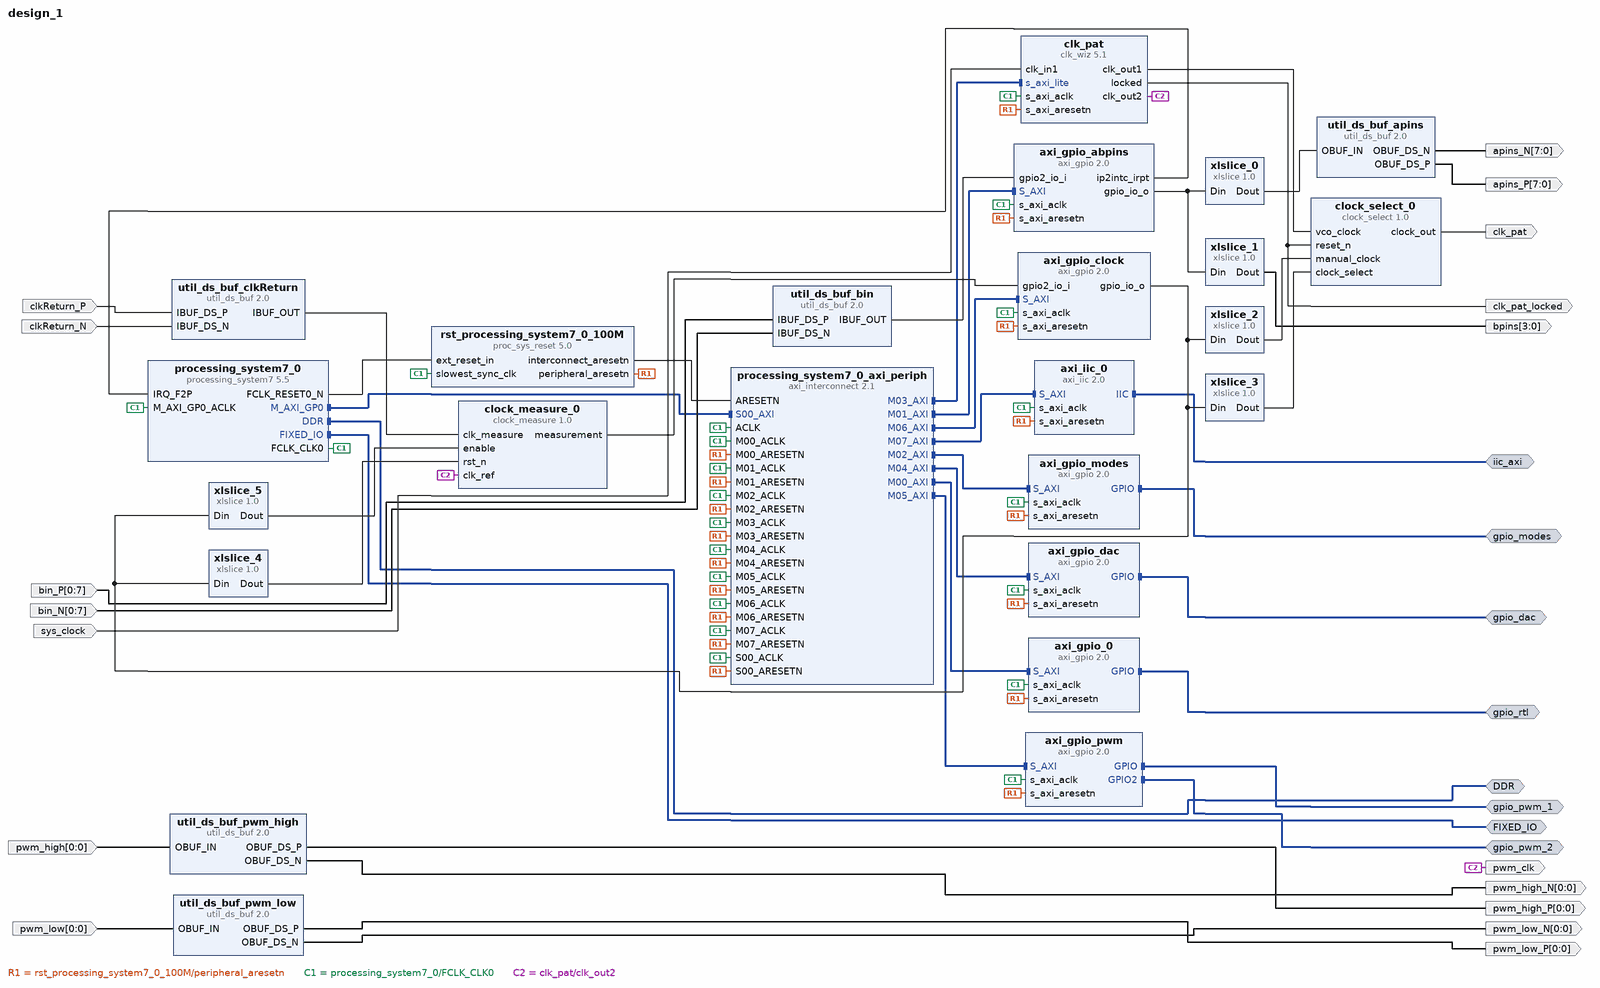
[diagram p0: block diagram of the top level]
# Vivado block design design_1, Vivado 2014.4
create_bd_design design_1

create_bd_intf_port -mode Master -vlnv xilinx.com:interface:ddrx_rtl:1.0 DDR
create_bd_intf_port -mode Master -vlnv xilinx.com:display_processing_system7:fixedio_rtl:1.0 FIXED_IO
create_bd_intf_port -mode Master -vlnv xilinx.com:interface:gpio_rtl:1.0 gpio_rtl
create_bd_intf_port -mode Master -vlnv xilinx.com:interface:gpio_rtl:1.0 gpio_modes
create_bd_intf_port -mode Master -vlnv xilinx.com:interface:gpio_rtl:1.0 gpio_dac
create_bd_intf_port -mode Master -vlnv xilinx.com:interface:gpio_rtl:1.0 gpio_pwm_1
create_bd_intf_port -mode Master -vlnv xilinx.com:interface:gpio_rtl:1.0 gpio_pwm_2
create_bd_intf_port -mode Master -vlnv xilinx.com:interface:iic_rtl:1.0 iic_axi
create_bd_port -dir I -from 0 -to 7 bin_P
create_bd_port -dir I -from 0 -to 7 bin_N
create_bd_port -dir O -from 3 -to 0 bpins
create_bd_port -dir I -type clk sys_clock
set_property -dict {CONFIG.FREQ_HZ 100000000 CONFIG.PHASE 0.000} [get_bd_ports sys_clock]
create_bd_port -dir O -from 0 -to 0 pwm_high_P
create_bd_port -dir O -from 0 -to 0 pwm_high_N
create_bd_port -dir O -from 0 -to 0 pwm_low_P
create_bd_port -dir O -from 0 -to 0 pwm_low_N
create_bd_port -dir I clkReturn_P
create_bd_port -dir I clkReturn_N
create_bd_port -dir O clk_pat
create_bd_port -dir I -from 0 -to 0 pwm_low
create_bd_port -dir I -from 0 -to 0 pwm_high
create_bd_port -dir O -type clk pwm_clk
create_bd_port -dir O clk_pat_locked
create_bd_port -dir O -from 7 -to 0 apins_P
create_bd_port -dir O -from 7 -to 0 apins_N

create_bd_cell -type ip -vlnv xilinx.com:ip:processing_system7:5.5 processing_system7_0
set_property -dict [list \
  CONFIG.PCW_USE_FABRIC_INTERRUPT 1 \
  CONFIG.PCW_IRQ_F2P_INTR 1 \
  CONFIG.PCW_SPI1_PERIPHERAL_ENABLE 1 \
  CONFIG.PCW_SPI1_SPI1_IO {MIO 10 .. 15} \
  CONFIG.PCW_I2C0_PERIPHERAL_ENABLE 1 \
  CONFIG.PCW_I2C0_I2C0_IO {MIO 14 .. 15} \
  CONFIG.PCW_I2C0_GRP_INT_ENABLE 0 \
  CONFIG.preset {ZedBoard*} \
] [get_bd_cells processing_system7_0]
# 10 more settings of processing_system7_0 are not shown: defaults, MIO pin electricals, DDR timing, and values the tool derives
create_bd_cell -type ip -vlnv xilinx.com:ip:axi_gpio:2.0 axi_gpio_0
set_property -dict [list \
  CONFIG.C_GPIO_WIDTH 16 \
  CONFIG.C_ALL_INPUTS 0 \
  CONFIG.USE_BOARD_FLOW true \
  CONFIG.GPIO_BOARD_INTERFACE Custom \
] [get_bd_cells axi_gpio_0]
create_bd_cell -type ip -vlnv xilinx.com:ip:axi_gpio:2.0 axi_gpio_modes
set_property -dict [list \
  CONFIG.C_GPIO_WIDTH 5 \
  CONFIG.C_ALL_INPUTS 0 \
  CONFIG.USE_BOARD_FLOW true \
  CONFIG.GPIO_BOARD_INTERFACE Custom \
  CONFIG.C_ALL_OUTPUTS 1 \
] [get_bd_cells axi_gpio_modes]
create_bd_cell -type ip -vlnv xilinx.com:ip:proc_sys_reset:5.0 rst_processing_system7_0_100M
create_bd_cell -type ip -vlnv xilinx.com:ip:axi_gpio:2.0 axi_gpio_dac
set_property -dict [list \
  CONFIG.C_GPIO_WIDTH 11 \
  CONFIG.C_DOUT_DEFAULT 0x00000400 \
  CONFIG.USE_BOARD_FLOW true \
  CONFIG.GPIO_BOARD_INTERFACE Custom \
  CONFIG.C_ALL_OUTPUTS 1 \
] [get_bd_cells axi_gpio_dac]
create_bd_cell -type ip -vlnv xilinx.com:ip:xlslice:1.0 xlslice_0
set_property -dict {CONFIG.DIN_TO 0 CONFIG.DIN_FROM 7 CONFIG.DIN_WIDTH 12} [get_bd_cells xlslice_0]
create_bd_cell -type ip -vlnv xilinx.com:ip:xlslice:1.0 xlslice_1
set_property -dict {CONFIG.DIN_TO 8 CONFIG.DIN_FROM 11 CONFIG.DIN_WIDTH 12} [get_bd_cells xlslice_1]
create_bd_cell -type ip -vlnv xilinx.com:ip:axi_gpio:2.0 axi_gpio_abpins
set_property -dict [list \
  CONFIG.C_GPIO_WIDTH 12 \
  CONFIG.C_GPIO2_WIDTH 8 \
  CONFIG.C_IS_DUAL 1 \
  CONFIG.C_ALL_INPUTS 0 \
  CONFIG.C_ALL_INPUTS_2 1 \
  CONFIG.C_INTERRUPT_PRESENT 1 \
  CONFIG.USE_BOARD_FLOW true \
  CONFIG.GPIO_BOARD_INTERFACE Custom \
  CONFIG.GPIO2_BOARD_INTERFACE Custom \
  CONFIG.C_ALL_OUTPUTS 1 \
] [get_bd_cells axi_gpio_abpins]
create_bd_cell -type ip -vlnv xilinx.com:ip:axi_gpio:2.0 axi_gpio_pwm
set_property -dict [list \
  CONFIG.C_GPIO_WIDTH 30 \
  CONFIG.C_GPIO2_WIDTH 20 \
  CONFIG.C_IS_DUAL 1 \
  CONFIG.C_DOUT_DEFAULT_2 0x0f0f0e0F \
  CONFIG.C_DOUT_DEFAULT 0xff00ff00 \
  CONFIG.C_ALL_OUTPUTS 1 \
  CONFIG.C_ALL_OUTPUTS_2 1 \
] [get_bd_cells axi_gpio_pwm]
create_bd_cell -type ip -vlnv xilinx.com:ip:axi_gpio:2.0 axi_gpio_clock
set_property -dict [list \
  CONFIG.C_GPIO_WIDTH 4 \
  CONFIG.C_GPIO2_WIDTH 20 \
  CONFIG.C_IS_DUAL 1 \
  CONFIG.C_DOUT_DEFAULT 0x00000000 \
  CONFIG.C_ALL_INPUTS_2 1 \
  CONFIG.C_INTERRUPT_PRESENT 0 \
  CONFIG.C_ALL_OUTPUTS 1 \
] [get_bd_cells axi_gpio_clock]
create_bd_cell -type ip -vlnv xilinx.com:ip:clk_wiz:5.1 clk_pat
set_property -dict [list \
  CONFIG.USE_PHASE_ALIGNMENT false \
  CONFIG.USE_DYN_PHASE_SHIFT false \
  CONFIG.USE_DYN_RECONFIG true \
  CONFIG.JITTER_SEL Min_O_Jitter \
  CONFIG.CLKOUT2_USED true \
  CONFIG.CLKOUT3_USED false \
  CONFIG.NUM_OUT_CLKS 2 \
  CONFIG.CLKOUT1_REQUESTED_OUT_FREQ 20 \
  CONFIG.CLKOUT2_REQUESTED_OUT_FREQ 100 \
  CONFIG.CLKOUT1_DRIVES BUFGCE \
  CONFIG.CLKOUT2_DRIVES BUFGCE \
  CONFIG.USE_SAFE_CLOCK_STARTUP true \
  CONFIG.USE_BOARD_FLOW true \
  CONFIG.CLK_IN1_BOARD_INTERFACE sys_clock \
  CONFIG.CLKOUT1_JITTER 174.686 \
  CONFIG.CLKOUT1_PHASE_ERROR 92.672 \
  CONFIG.CLKOUT2_JITTER 123.670 \
  CONFIG.CLKOUT2_PHASE_ERROR 92.672 \
  CONFIG.CLKOUT3_JITTER 97.082 \
  CONFIG.CLKOUT3_PHASE_ERROR 98.575 \
] [get_bd_cells clk_pat]
create_bd_cell -type ip -vlnv xilinx.com:ip:axi_interconnect:2.1 processing_system7_0_axi_periph
set_property -dict {CONFIG.NUM_MI 8} [get_bd_cells processing_system7_0_axi_periph]
create_bd_cell -type ip -vlnv xilinx.com:ip:util_ds_buf:2.0 util_ds_buf_bin
set_property -dict {CONFIG.C_SIZE 8} [get_bd_cells util_ds_buf_bin]
create_bd_cell -type ip -vlnv xilinx.com:ip:util_ds_buf:2.0 util_ds_buf_pwm_high
set_property -dict {CONFIG.C_BUF_TYPE OBUFDS} [get_bd_cells util_ds_buf_pwm_high]
create_bd_cell -type ip -vlnv xilinx.com:ip:util_ds_buf:2.0 util_ds_buf_pwm_low
set_property -dict {CONFIG.C_BUF_TYPE OBUFDS} [get_bd_cells util_ds_buf_pwm_low]
create_bd_cell -type ip -vlnv xilinx.com:ip:util_ds_buf:2.0 util_ds_buf_clkReturn
create_bd_cell -type ip -vlnv ac.uk:user:clock_select:1.0 clock_select_0
create_bd_cell -type ip -vlnv xilinx.com:ip:xlslice:1.0 xlslice_2
set_property -dict {CONFIG.DIN_WIDTH 4} [get_bd_cells xlslice_2]
create_bd_cell -type ip -vlnv xilinx.com:ip:xlslice:1.0 xlslice_3
set_property -dict {CONFIG.DIN_TO 1 CONFIG.DIN_FROM 1 CONFIG.DIN_WIDTH 4} [get_bd_cells xlslice_3]
create_bd_cell -type ip -vlnv simon.cs.bris.ac.uk:user:clock_measure:1.0 clock_measure_0
create_bd_cell -type ip -vlnv xilinx.com:ip:xlslice:1.0 xlslice_4
set_property -dict {CONFIG.DIN_TO 2 CONFIG.DIN_FROM 2 CONFIG.DIN_WIDTH 4} [get_bd_cells xlslice_4]
create_bd_cell -type ip -vlnv xilinx.com:ip:xlslice:1.0 xlslice_5
set_property -dict {CONFIG.DIN_TO 3 CONFIG.DIN_FROM 3 CONFIG.DIN_WIDTH 4} [get_bd_cells xlslice_5]
create_bd_cell -type ip -vlnv xilinx.com:ip:axi_iic:2.0 axi_iic_0
create_bd_cell -type ip -vlnv xilinx.com:ip:util_ds_buf:2.0 util_ds_buf_apins
set_property -dict {CONFIG.C_SIZE 8 CONFIG.C_BUF_TYPE OBUFDS} [get_bd_cells util_ds_buf_apins]

# ---- connections ----

connect_bd_intf_net [get_bd_intf_pins processing_system7_0_axi_periph/M00_AXI] [get_bd_intf_pins axi_gpio_0/S_AXI]
connect_bd_intf_net [get_bd_intf_pins processing_system7_0_axi_periph/M02_AXI] [get_bd_intf_pins axi_gpio_modes/S_AXI]
connect_bd_intf_net [get_bd_intf_pins processing_system7_0_axi_periph/M01_AXI] [get_bd_intf_pins axi_gpio_abpins/S_AXI]
connect_bd_intf_net [get_bd_intf_pins processing_system7_0/M_AXI_GP0] [get_bd_intf_pins processing_system7_0_axi_periph/S00_AXI]
connect_bd_intf_net [get_bd_intf_pins processing_system7_0_axi_periph/M03_AXI] [get_bd_intf_pins clk_pat/s_axi_lite]
connect_bd_intf_net [get_bd_intf_pins processing_system7_0_axi_periph/M04_AXI] [get_bd_intf_pins axi_gpio_dac/S_AXI]
connect_bd_intf_net [get_bd_intf_pins processing_system7_0_axi_periph/M05_AXI] [get_bd_intf_pins axi_gpio_pwm/S_AXI]
connect_bd_intf_net [get_bd_intf_pins processing_system7_0_axi_periph/M06_AXI] [get_bd_intf_pins axi_gpio_clock/S_AXI]
connect_bd_intf_net [get_bd_intf_pins processing_system7_0_axi_periph/M07_AXI] [get_bd_intf_pins axi_iic_0/S_AXI]
connect_bd_intf_net [get_bd_intf_ports DDR] [get_bd_intf_pins processing_system7_0/DDR]
connect_bd_intf_net [get_bd_intf_ports FIXED_IO] [get_bd_intf_pins processing_system7_0/FIXED_IO]
connect_bd_intf_net [get_bd_intf_ports gpio_rtl] [get_bd_intf_pins axi_gpio_0/GPIO]
connect_bd_intf_net [get_bd_intf_ports gpio_modes] [get_bd_intf_pins axi_gpio_modes/GPIO]
connect_bd_intf_net [get_bd_intf_ports gpio_dac] [get_bd_intf_pins axi_gpio_dac/GPIO]
connect_bd_intf_net [get_bd_intf_ports gpio_pwm_1] [get_bd_intf_pins axi_gpio_pwm/GPIO]
connect_bd_intf_net [get_bd_intf_ports gpio_pwm_2] [get_bd_intf_pins axi_gpio_pwm/GPIO2]
connect_bd_intf_net [get_bd_intf_ports iic_axi] [get_bd_intf_pins axi_iic_0/IIC]
connect_bd_net [get_bd_pins processing_system7_0/FCLK_RESET0_N] [get_bd_pins rst_processing_system7_0_100M/ext_reset_in]
connect_bd_net [get_bd_pins rst_processing_system7_0_100M/peripheral_aresetn] \
  [get_bd_pins axi_gpio_0/s_axi_aresetn] [get_bd_pins axi_gpio_modes/s_axi_aresetn] [get_bd_pins axi_gpio_dac/s_axi_aresetn] \
  [get_bd_pins axi_gpio_abpins/s_axi_aresetn] [get_bd_pins axi_gpio_pwm/s_axi_aresetn] [get_bd_pins clk_pat/s_axi_aresetn] \
  [get_bd_pins axi_gpio_clock/s_axi_aresetn] [get_bd_pins axi_iic_0/s_axi_aresetn] \
  [get_bd_pins processing_system7_0_axi_periph/S00_ARESETN] [get_bd_pins processing_system7_0_axi_periph/M00_ARESETN] \
  [get_bd_pins processing_system7_0_axi_periph/M01_ARESETN] [get_bd_pins processing_system7_0_axi_periph/M02_ARESETN] \
  [get_bd_pins processing_system7_0_axi_periph/M03_ARESETN] [get_bd_pins processing_system7_0_axi_periph/M04_ARESETN] \
  [get_bd_pins processing_system7_0_axi_periph/M05_ARESETN] [get_bd_pins processing_system7_0_axi_periph/M06_ARESETN] \
  [get_bd_pins processing_system7_0_axi_periph/M07_ARESETN]
connect_bd_net [get_bd_pins rst_processing_system7_0_100M/interconnect_aresetn] [get_bd_pins processing_system7_0_axi_periph/ARESETN]
connect_bd_net -net IBUF_DS_P_1 [get_bd_ports bin_P] [get_bd_pins util_ds_buf_bin/IBUF_DS_P]
connect_bd_net -net IBUF_DS_N_1 [get_bd_ports bin_N] [get_bd_pins util_ds_buf_bin/IBUF_DS_N]
connect_bd_net [get_bd_pins axi_gpio_abpins/gpio_io_o] [get_bd_pins xlslice_0/Din] [get_bd_pins xlslice_1/Din]
connect_bd_net [get_bd_pins xlslice_1/Dout] [get_bd_ports bpins]
connect_bd_net [get_bd_pins util_ds_buf_bin/IBUF_OUT] [get_bd_pins axi_gpio_abpins/gpio2_io_i]
connect_bd_net [get_bd_pins axi_gpio_abpins/ip2intc_irpt] [get_bd_pins processing_system7_0/IRQ_F2P]
connect_bd_net [get_bd_pins processing_system7_0/FCLK_CLK0] \
  [get_bd_pins processing_system7_0/M_AXI_GP0_ACLK] [get_bd_pins rst_processing_system7_0_100M/slowest_sync_clk] \
  [get_bd_pins axi_gpio_0/s_axi_aclk] [get_bd_pins axi_gpio_modes/s_axi_aclk] [get_bd_pins axi_gpio_dac/s_axi_aclk] \
  [get_bd_pins axi_gpio_abpins/s_axi_aclk] [get_bd_pins axi_gpio_pwm/s_axi_aclk] [get_bd_pins clk_pat/s_axi_aclk] \
  [get_bd_pins axi_gpio_clock/s_axi_aclk] [get_bd_pins axi_iic_0/s_axi_aclk] \
  [get_bd_pins processing_system7_0_axi_periph/ACLK] [get_bd_pins processing_system7_0_axi_periph/S00_ACLK] \
  [get_bd_pins processing_system7_0_axi_periph/M00_ACLK] [get_bd_pins processing_system7_0_axi_periph/M01_ACLK] \
  [get_bd_pins processing_system7_0_axi_periph/M02_ACLK] [get_bd_pins processing_system7_0_axi_periph/M03_ACLK] \
  [get_bd_pins processing_system7_0_axi_periph/M04_ACLK] [get_bd_pins processing_system7_0_axi_periph/M05_ACLK] \
  [get_bd_pins processing_system7_0_axi_periph/M06_ACLK] [get_bd_pins processing_system7_0_axi_periph/M07_ACLK]
connect_bd_net [get_bd_ports sys_clock] [get_bd_pins clk_pat/clk_in1]
connect_bd_net [get_bd_pins util_ds_buf_pwm_high/OBUF_DS_P] [get_bd_ports pwm_high_P]
connect_bd_net [get_bd_pins util_ds_buf_pwm_high/OBUF_DS_N] [get_bd_ports pwm_high_N]
connect_bd_net [get_bd_pins util_ds_buf_pwm_low/OBUF_DS_P] [get_bd_ports pwm_low_P]
connect_bd_net [get_bd_pins util_ds_buf_pwm_low/OBUF_DS_N] [get_bd_ports pwm_low_N]
connect_bd_net [get_bd_ports clkReturn_P] [get_bd_pins util_ds_buf_clkReturn/IBUF_DS_P]
connect_bd_net [get_bd_ports clkReturn_N] [get_bd_pins util_ds_buf_clkReturn/IBUF_DS_N]
connect_bd_net [get_bd_pins xlslice_2/Dout] [get_bd_pins clock_select_0/manual_clock]
connect_bd_net [get_bd_pins xlslice_3/Dout] [get_bd_pins clock_select_0/clock_select]
connect_bd_net [get_bd_pins clk_pat/clk_out1] [get_bd_pins clock_select_0/vco_clock]
connect_bd_net [get_bd_pins clock_select_0/clock_out] [get_bd_ports clk_pat]
connect_bd_net [get_bd_pins axi_gpio_clock/gpio_io_o] \
  [get_bd_pins xlslice_2/Din] [get_bd_pins xlslice_3/Din] [get_bd_pins xlslice_4/Din] [get_bd_pins xlslice_5/Din]
connect_bd_net [get_bd_ports pwm_low] [get_bd_pins util_ds_buf_pwm_low/OBUF_IN]
connect_bd_net [get_bd_ports pwm_high] [get_bd_pins util_ds_buf_pwm_high/OBUF_IN]
connect_bd_net [get_bd_pins clk_pat/clk_out2] [get_bd_ports pwm_clk] [get_bd_pins clock_measure_0/clk_ref]
connect_bd_net [get_bd_pins util_ds_buf_clkReturn/IBUF_OUT] [get_bd_pins clock_measure_0/clk_measure]
connect_bd_net [get_bd_pins xlslice_5/Dout] [get_bd_pins clock_measure_0/enable]
connect_bd_net [get_bd_pins xlslice_4/Dout] [get_bd_pins clock_measure_0/rst_n]
connect_bd_net [get_bd_pins clock_measure_0/measurement] [get_bd_pins axi_gpio_clock/gpio2_io_i]
connect_bd_net [get_bd_pins clk_pat/locked] [get_bd_ports clk_pat_locked] [get_bd_pins clock_select_0/reset_n]
connect_bd_net [get_bd_pins xlslice_0/Dout] [get_bd_pins util_ds_buf_apins/OBUF_IN]
connect_bd_net -net util_ds_buf_0_OBUF_DS_P [get_bd_pins util_ds_buf_apins/OBUF_DS_P] [get_bd_ports apins_P]
connect_bd_net -net util_ds_buf_0_OBUF_DS_N [get_bd_pins util_ds_buf_apins/OBUF_DS_N] [get_bd_ports apins_N]

# ---- address map ----
assign_bd_address -offset 0x41200000 -range 64K -target_address_space [get_bd_addr_spaces processing_system7_0/Data] [get_bd_addr_segs axi_gpio_dac/S_AXI/Reg]
assign_bd_address -offset 0x41210000 -range 64K -target_address_space [get_bd_addr_spaces processing_system7_0/Data] [get_bd_addr_segs axi_gpio_pwm/S_AXI/Reg]
assign_bd_address -offset 0x41220000 -range 64K -target_address_space [get_bd_addr_spaces processing_system7_0/Data] [get_bd_addr_segs axi_gpio_0/S_AXI/Reg]
assign_bd_address -offset 0x41230000 -range 64K -target_address_space [get_bd_addr_spaces processing_system7_0/Data] [get_bd_addr_segs axi_gpio_modes/S_AXI/Reg]
assign_bd_address -offset 0x41240000 -range 64K -target_address_space [get_bd_addr_spaces processing_system7_0/Data] [get_bd_addr_segs axi_gpio_abpins/S_AXI/Reg]
assign_bd_address -offset 0x41250000 -range 64K -target_address_space [get_bd_addr_spaces processing_system7_0/Data] [get_bd_addr_segs axi_gpio_clock/S_AXI/Reg]
assign_bd_address -offset 0x41600000 -range 64K -target_address_space [get_bd_addr_spaces processing_system7_0/Data] [get_bd_addr_segs axi_iic_0/S_AXI/Reg]
assign_bd_address -offset 0x43C00000 -range 64K -target_address_space [get_bd_addr_spaces processing_system7_0/Data] [get_bd_addr_segs clk_pat/s_axi_lite/Reg]

validate_bd_design
save_bd_design
